# EAGLE schematic AD5293-adapter (EAGLE 7.3.0)
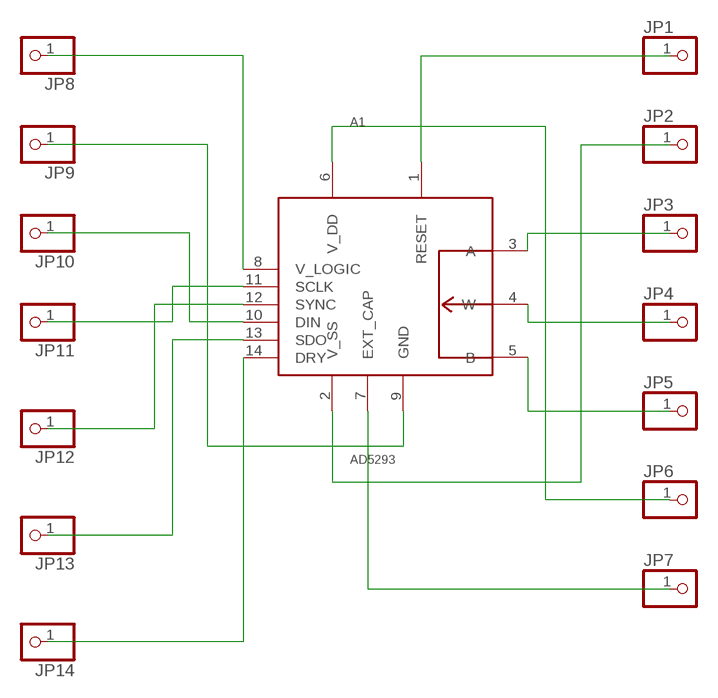
[diagram p0: schematic, sheet 1]

## Parts
A1  AD5293  [AD5293]
JP1  PINHD-1X1-SQUARE  [1X01-SQUARE]
JP2  PINHD-1X1  [1X01]
JP3  PINHD-1X1  [1X01]
JP4  PINHD-1X1  [1X01]
JP5  PINHD-1X1  [1X01]
JP6  PINHD-1X1  [1X01]
JP7  PINHD-1X1  [1X01]
JP8  PINHD-1X1  [1X01]
JP9  PINHD-1X1  [1X01]
JP10  PINHD-1X1  [1X01]
JP11  PINHD-1X1  [1X01]
JP12  PINHD-1X1  [1X01]
JP13  PINHD-1X1  [1X01]
JP14  PINHD-1X1  [1X01]

## Nets
N$2: A1.1(RESET) JP1.1
N$3: A1.2(V_SS) JP2.1
N$4: A1.3(A) JP3.1
N$5: A1.4(W) JP4.1
N$6: A1.5(B) JP5.1
N$7: A1.7(EXT_CAP) JP7.1
N$8: A1.8(V_LOGIC) JP8.1
N$9: A1.9(GND) JP9.1
N$10: A1.10(DIN) JP10.1
N$11: A1.11(SCLK) JP11.1
N$12: A1.12(SYNC) JP12.1
N$13: A1.13(SDO) JP13.1
N$14: A1.14(DRY) JP14.1
N$15: A1.6(V_DD) JP6.1

## Library data of the parts
A1 = Marcell:AD5293
JP1 = pinhead:PINHD-1X1-SQUARE: PIN HEADER
JP2-JP14 = pinhead:PINHD-1X1: PIN HEADER